# Altium schematic sheet obc-v2_POWER.SchDoc
size 420 x 297 mm; SheetNumber: 4; SheetTotal: 23
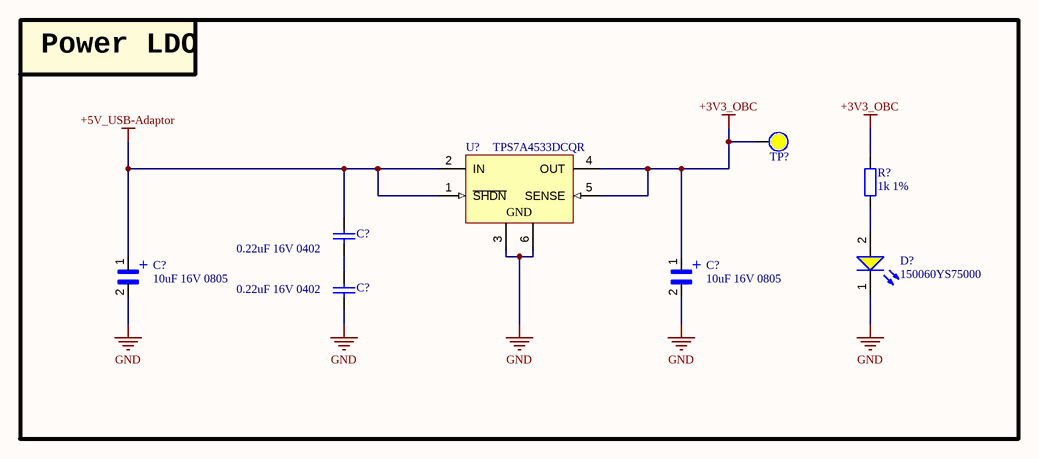
[diagram p0: obc-v2_POWER.SchDoc]

## Parts
(Parts that share a designator on the sheet are numbered #1, #2 ... from top to bottom, then left to right.)
C?#1  0.22uF 16V 0402  [tu 0402]
C?#2  10uF 16V 0805  [CAPC2012X140N]
C?#3  10uF 16V 0805  [CAPC2012X140N]
C?#4  0.22uF 16V 0402  [tu 0402]
D?  150060YS75000  [WL-SMCW_0603_150060xx75000]
R?  1k 1%  [tro smd 0603]
TP?  (no value)  [Test Point 1 Side]  (no BOM)
U?  TPS7A4533DCQR  [DCQ0006A_M]

## Blocks framed on the sheet
Power LDO: C?#1-C?#4 D? R? TP? U?

## Nets
+3V3_OBC: C?#3.1 R?.2 TP?.0 U?.4(OUT) U?.5(SENSE)
+5V_USB-Adaptor: C?#1.1 C?#2.1 U?.1(~{SHDN}) U?.2(IN)
GND: C?#2.2 C?#3.2 C?#4.2 D?.1(K) U?.3(GND) U?.6(GND)
NetC?#1_2: C?#1.2 C?#4.1
NetD?_2: D?.2(A) R?.1

## Notes on the sheet
- Project:
- Sub-system:
- Design by:
- Sheet title:
- Sheet
- A3
- of
- Checked by:
- Approved by:
- Revision:
- Document No:
- Size:
- Date:
- (in symbol TACR686M003RTA) +

## Library data of the parts
C?#1 C?#4 = Tu 0402 33nF 10V: 0.22 µF ±10% 16V Ceramic Capacitor X7R 0402 (1005 Metric): GCM155R71C224KE02D; Chung_Loai: Dán; Don_Vi: Con; So_Chan: 2; Ten_Linh_Kien: Tụ 0402 33nF X7R 10V GRM155R71A333KA01D; Ma_Hang: MH007853; Kieu_Chan: *
C?#2 C?#3 = TACR686M003RTA: 10 µF Molded Tantalum Capacitors 16 V 0805 (2012 Metric) 8Ohm @ 100kHz: TP8R106M016C; MF: AVX; Availability: Unavailable; SnapEDA_Link: https://www.snapeda.com/parts/TACR686M003RTA/AVX/view-part/1745975/?ref=snap; MP: TACR686M003RTA; Value: *; Price: None; Package: 0805 AVX
D? = CMP-1426-00005-2: LED YELLOW CLEAR 0603 SMD; NexarPartId: 29687085; Wavelength: 590nm; Luminous Intensity: 120mcd; Peak Wavelength: 595nm; Forward Current: 100mA; Power Dissipation: 72mW; Forward Voltage: 2V; Test Current: 20mA; Reverse Voltage: 5V; Lens Style: Clear, Rectangular; Max Junction Temperature (Tj): 95°C; Viewing Angle: 140°; Case Code (Imperial): 0603; Height: 700µm; REACH SVHC: Unknown; Dominant Wavelength: 590nm; Min Operating Temperature: -40°C; Color: Yellow; Width: 800µm; Mount: Surface Mount; Packaging: Tape and Reel; Max Operating Temperature: 85°C; RoHS: Compliant; Max Reverse Voltage (DC): 5V; Case Code (Metric): 1608; Length: 1.6mm; Case/Package: 0603
R? = Tro 0603 1% 10k: RES SMD 2.2K OHM 1% 1/10W 0603, P/N: ERJ-3EKF2201V; Chung_Loai: Dán; Don_Vi: Con; So_Chan: 2; Ten_Linh_Kien: Trở 0603 1% 10k; Ma_Hang: MH006333; Kieu_Chan: *
TP? = Test Point: Solder: NF
U? = CMP-0395-00360-2: Single Output Fast Transient Response LDO, 1.5 A, Fixed 3.3 V Output, 2.1 to 20 V Input, 6-pin SOT-223 (DCQ), -40 to 125 degC, Green (RoHS & no Sb/Br); Manufacturer: Texas Instruments; Vout Adj(Max)(V): 3.3; Vin(Max)(V): 20; Accuracy(%): 1; SubFamily: Single Channel LDO; Vin(Min)(V): 2.1; Iout(Max)(A): 1.5; Vdo(Typ)(mV): 300; Eco-Plan: Green (RoHS & no Sb/Br); Mounting Technology: Surface Mount; PackageDescription: 6-Pin Plastic Small Outline, Body 3.5 x 6.5 mm, Pitch 1.27 mm; ComponentLink2URL: http://www.ti.com/general/docs/lit/getliterature.tsp?genericPartNumber=TPS7A4533&fileType=pdf; PackageReference: DCQ0006A; ComponentLink3Description: Package Specification; ComponentLink2Description: Datasheet; Fixed Output Options(V): 3.3; Iq(Typ)(mA): 1; ComponentLink1URL: http://www.ti.com/; PartNumber: TPS7A4533DCQR; ComponentLink1Description: Manufacturer URL; PackageVersion: 4202109/D; Vout Adj(Min)(V): 3.3; DatasheetVersion: SLVS720D; ComponentLink3URL: http://www.ti.com/litv/pdf/mpds098c